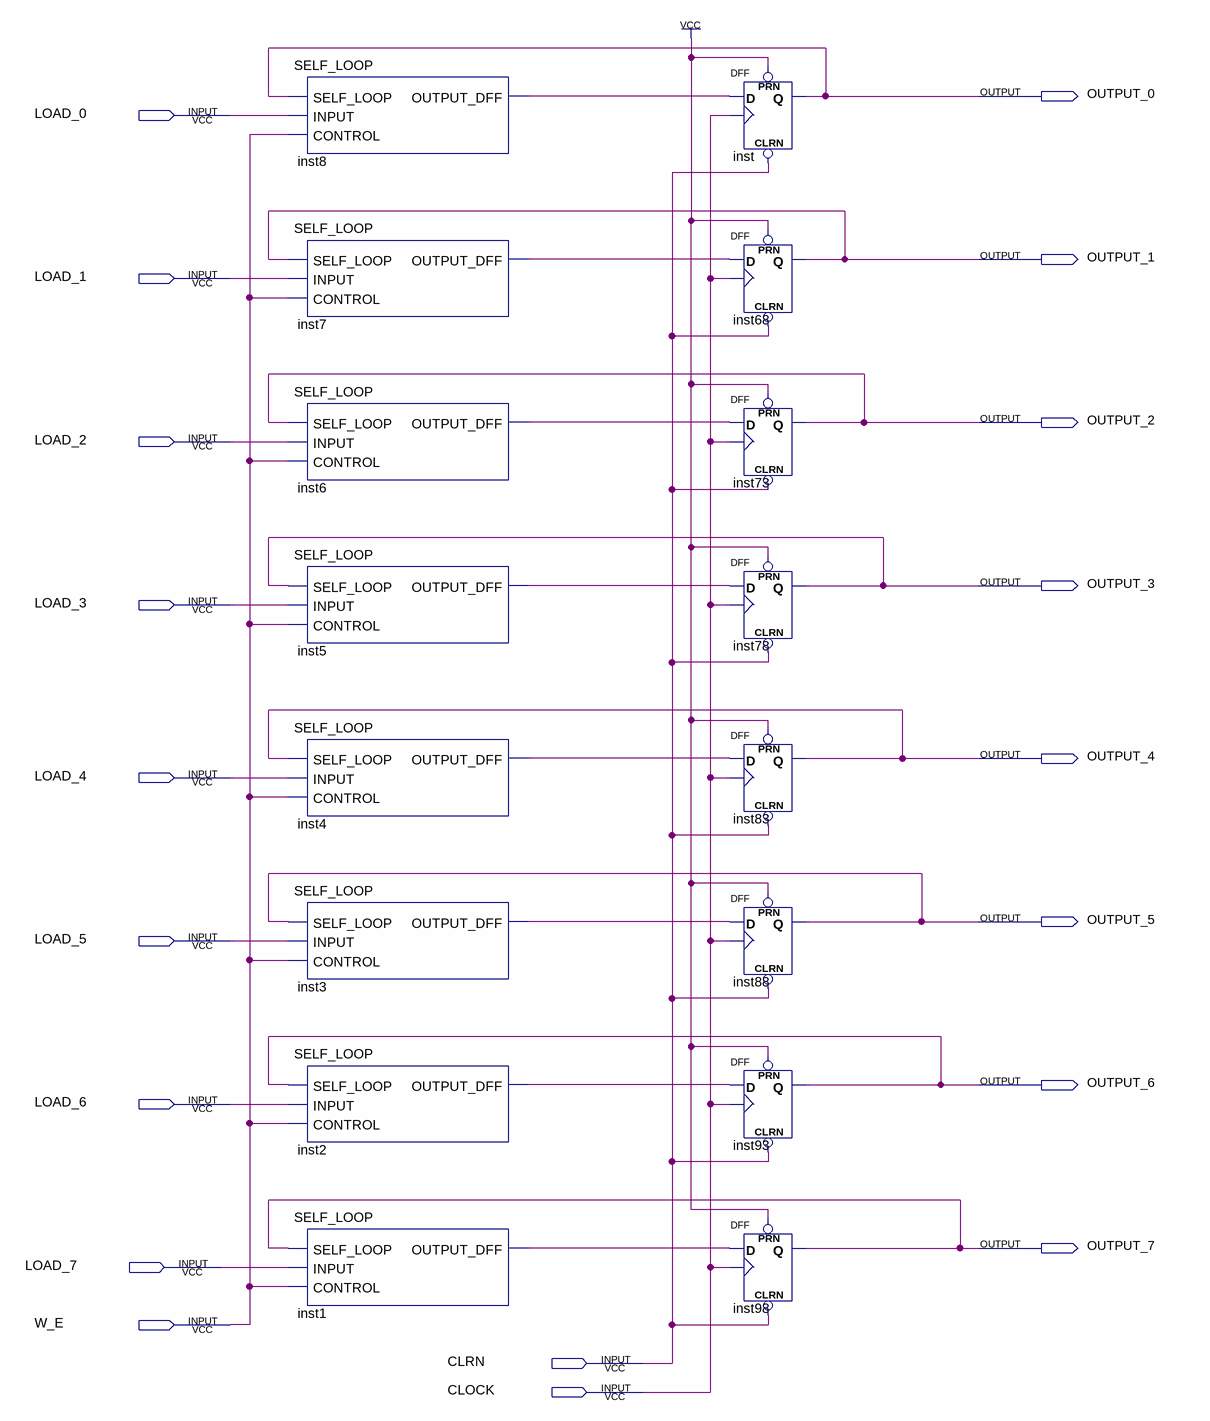
[diagram p0: schematic sheet]
// Quartus schematic Register.bdf as structural Verilog: 16 symbols, 19 pins
module Register (
  input  LOAD_0,
  input  LOAD_1,
  input  LOAD_2,
  input  LOAD_3,
  input  LOAD_4,
  input  LOAD_5,
  input  LOAD_6,
  input  LOAD_7,
  input  W_E,
  input  CLRN,
  input  CLOCK,
  output OUTPUT_0,
  output OUTPUT_1,
  output OUTPUT_2,
  output OUTPUT_3,
  output OUTPUT_4,
  output OUTPUT_5,
  output OUTPUT_6,
  output OUTPUT_7
);

  wire inst1_output_dff, inst2_output_dff, inst3_output_dff, inst4_output_dff, inst5_output_dff,
       inst6_output_dff, inst7_output_dff, inst8_output_dff;

  SELF_LOOP inst8 (.SELF_LOOP(OUTPUT_0), .INPUT(LOAD_0), .CONTROL(W_E), .OUTPUT_DFF(inst8_output_dff));
  SELF_LOOP inst7 (.SELF_LOOP(OUTPUT_1), .INPUT(LOAD_1), .CONTROL(W_E), .OUTPUT_DFF(inst7_output_dff));
  SELF_LOOP inst6 (.SELF_LOOP(OUTPUT_2), .INPUT(LOAD_2), .CONTROL(W_E), .OUTPUT_DFF(inst6_output_dff));
  SELF_LOOP inst5 (.SELF_LOOP(OUTPUT_3), .INPUT(LOAD_3), .CONTROL(W_E), .OUTPUT_DFF(inst5_output_dff));
  SELF_LOOP inst4 (.SELF_LOOP(OUTPUT_4), .INPUT(LOAD_4), .CONTROL(W_E), .OUTPUT_DFF(inst4_output_dff));
  SELF_LOOP inst3 (.SELF_LOOP(OUTPUT_5), .INPUT(LOAD_5), .CONTROL(W_E), .OUTPUT_DFF(inst3_output_dff));
  SELF_LOOP inst2 (.SELF_LOOP(OUTPUT_6), .INPUT(LOAD_6), .CONTROL(W_E), .OUTPUT_DFF(inst2_output_dff));
  SELF_LOOP inst1 (.SELF_LOOP(OUTPUT_7), .INPUT(LOAD_7), .CONTROL(W_E), .OUTPUT_DFF(inst1_output_dff));
  DFF inst (.CLRN(CLRN), .CLK(CLOCK), .D(inst8_output_dff), .PRN(1'b1), .Q(OUTPUT_0));
  DFF inst68 (.CLRN(CLRN), .CLK(CLOCK), .D(inst7_output_dff), .PRN(1'b1), .Q(OUTPUT_1));
  DFF inst73 (.CLRN(CLRN), .CLK(CLOCK), .D(inst6_output_dff), .PRN(1'b1), .Q(OUTPUT_2));
  DFF inst78 (.CLRN(CLRN), .CLK(CLOCK), .D(inst5_output_dff), .PRN(1'b1), .Q(OUTPUT_3));
  DFF inst83 (.CLRN(CLRN), .CLK(CLOCK), .D(inst4_output_dff), .PRN(1'b1), .Q(OUTPUT_4));
  DFF inst88 (.CLRN(CLRN), .CLK(CLOCK), .D(inst3_output_dff), .PRN(1'b1), .Q(OUTPUT_5));
  DFF inst93 (.CLRN(CLRN), .CLK(CLOCK), .D(inst2_output_dff), .PRN(1'b1), .Q(OUTPUT_6));
  DFF inst98 (.CLRN(CLRN), .CLK(CLOCK), .D(inst1_output_dff), .PRN(1'b1), .Q(OUTPUT_7));
endmodule
